# Altium project LEDS.PrjPcb
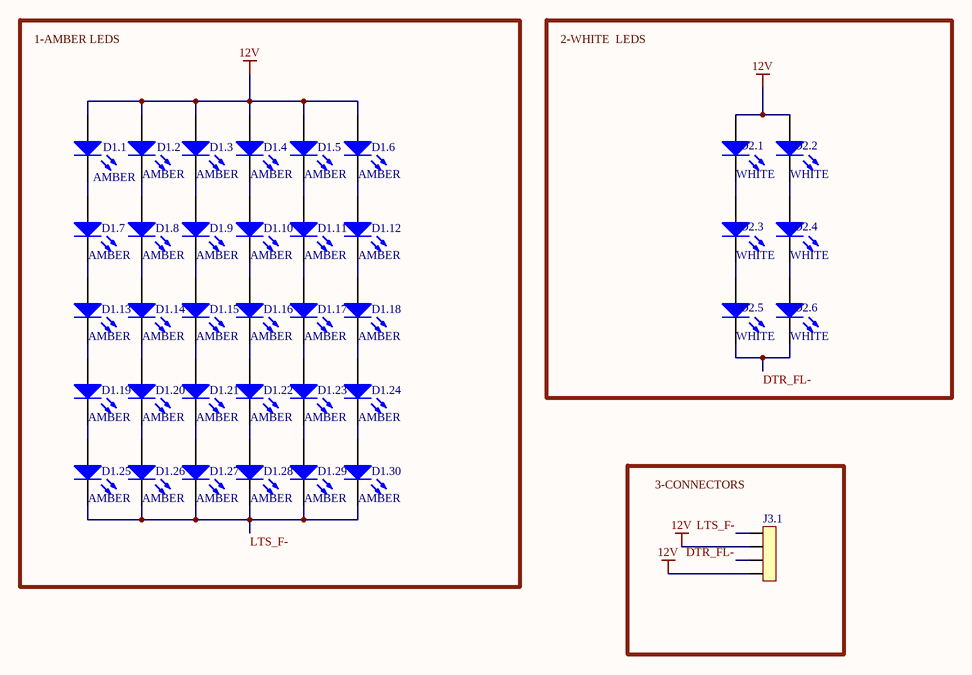
[diagram p0: LEDBoard.SchDoc]
1 sheet, 37 parts. Net scope: global (net labels, ports and power ports of the same name join across sheets).
Board file: LEDBoard.PcbDoc

## Sheet LEDBoard.SchDoc
size A4

### Parts
D1.1  AMBER  [150120AS75000]
D1.2  AMBER  [150120AS75000]
D1.3  AMBER  [150120AS75000]
D1.4  AMBER  [150120AS75000]
D1.5  AMBER  [150120AS75000]
D1.6  AMBER  [150120AS75000]
D1.7  AMBER  [150120AS75000]
D1.8  AMBER  [150120AS75000]
D1.9  AMBER  [150120AS75000]
D1.10  AMBER  [150120AS75000]
D1.11  AMBER  [150120AS75000]
D1.12  AMBER  [150120AS75000]
D1.13  AMBER  [150120AS75000]
D1.14  AMBER  [150120AS75000]
D1.15  AMBER  [150120AS75000]
D1.16  AMBER  [150120AS75000]
D1.17  AMBER  [150120AS75000]
D1.18  AMBER  [150120AS75000]
D1.19  AMBER  [150120AS75000]
D1.20  AMBER  [150120AS75000]
D1.21  AMBER  [150120AS75000]
D1.22  AMBER  [150120AS75000]
D1.23  AMBER  [150120AS75000]
D1.24  AMBER  [150120AS75000]
D1.25  AMBER  [150120AS75000]
D1.26  AMBER  [150120AS75000]
D1.27  AMBER  [150120AS75000]
D1.28  AMBER  [150120AS75000]
D1.29  AMBER  [150120AS75000]
D1.30  AMBER  [150120AS75000]
D2.1  WHITE  [HSMW-C170-U0000]
D2.2  WHITE  [HSMW-C170-U0000]
D2.3  WHITE  [HSMW-C170-U0000]
D2.4  WHITE  [HSMW-C170-U0000]
D2.5  WHITE  [HSMW-C170-U0000]
D2.6  WHITE  [HSMW-C170-U0000]
J3.1  B04B-XASK-1-A(LF)(SN)  [B04B-XASK-1-A]  (value not drawn)

### Blocks framed on the sheet
1-AMBER LEDS: D1.1-D1.30
2-WHITE  LEDS: D2.1-D2.6
3-CONNECTORS: J3.1

### Nets
12V: D1.1.2(A) D1.2.2(A) D1.3.2(A) D1.4.2(A) D1.5.2(A) D1.6.2(A) D2.1.2(A) D2.2.2(A) J3.1.2 J3.1.4
DTR_FL-: D2.5.1(K) D2.6.1(K) J3.1.3
LTS_F-: D1.25.1(K) D1.26.1(K) D1.27.1(K) D1.28.1(K) D1.29.1(K) D1.30.1(K) J3.1.1
NetD1.1_1: D1.1.1(K) D1.7.2(A)
NetD1.2_1: D1.2.1(K) D1.8.2(A)
NetD1.3_1: D1.3.1(K) D1.9.2(A)
NetD1.4_1: D1.4.1(K) D1.10.2(A)
NetD1.5_1: D1.5.1(K) D1.11.2(A)
NetD1.6_1: D1.6.1(K) D1.12.2(A)
NetD1.7_1: D1.7.1(K) D1.13.2(A)
NetD1.8_1: D1.8.1(K) D1.14.2(A)
NetD1.9_1: D1.9.1(K) D1.15.2(A)
NetD1.10_1: D1.10.1(K) D1.16.2(A)
NetD1.11_1: D1.11.1(K) D1.17.2(A)
NetD1.12_1: D1.12.1(K) D1.18.2(A)
NetD1.13_1: D1.13.1(K) D1.19.2(A)
NetD1.14_1: D1.14.1(K) D1.20.2(A)
NetD1.15_1: D1.15.1(K) D1.21.2(A)
NetD1.16_1: D1.16.1(K) D1.22.2(A)
NetD1.17_1: D1.17.1(K) D1.23.2(A)
NetD1.18_1: D1.18.1(K) D1.24.2(A)
NetD1.19_1: D1.19.1(K) D1.25.2(A)
NetD1.20_1: D1.20.1(K) D1.26.2(A)
NetD1.21_1: D1.21.1(K) D1.27.2(A)
NetD1.22_1: D1.22.1(K) D1.28.2(A)
NetD1.23_1: D1.23.1(K) D1.29.2(A)
NetD1.24_1: D1.24.1(K) D1.30.2(A)
NetD2.1_1: D2.1.1(K) D2.3.2(A)
NetD2.2_1: D2.2.1(K) D2.4.2(A)
NetD2.3_1: D2.3.1(K) D2.5.2(A)
NetD2.4_1: D2.4.1(K) D2.6.2(A)

### Library data of the parts
D1.1-D1.30 = 150120AS75000: WURTH ELEKTRONIK   150120AS75000   LED, 1206, AMBER, 140MCD, 605NM; Manufacturer 1: Wurth Electronics; Color: Orange; Forward Current: 30mA; Forward Voltage: 2V; Viewing Angle: 140°; Lens Style: Clear,Rectangular; Test Current: 20mA; Supplier 1: Digi-Key; Manufacturer Part Number 1: 150120AS75000; Stock 1: 2478; Pricing 1: 1=0.21000, 50=0.19800, 100=0.17100, 500=0.14800 (USD); RoHS: Yes; Mount: Surface Mount; Case/Package: 1206; Case Code (Metric): 3216; Case Code (Imperial): 1206; Min Operating Temperature: -40°C; Max Operating Temperature: 85°C; Luminous Intensity: 140mcd; Package Quantity: 3000; Packaging: Tape and Reel; Wavelength: 605nm; Dominant Wavelength: 605nm; Length: 3.2mm; Height: 0.68mm; Width: 1.6mm; REACH SVHC: Unknown; ComponentLink1URL: https://datasheet.ciiva.com/29561/150120as75000-29561877.pdf?src-supplier=Digi-Key; ComponentLink1Description: https://datasheet.ciiva.com/29561/150120as75000-29561877.pdf?src-supplier=Digi-Key; ComponentLink2URL: https://datasheet.ciiva.com/29279/759439-da-01-en-chipled-1206-w-kl-amb-150120as75000-29279037.pdf?src-supplier=Conrad; ComponentLink2Description: https://datasheet.ciiva.com/29279/759439-da-01-en-chipled-1206-w-kl-amb-150120as75000-29279037.pdf?src-supplier=Conrad; ComponentLink3URL: https://datasheet.ciiva.com/29561/150120as75000-29561878.pdf?src-supplier=Digi-Key; ComponentLink3Description: https://datasheet.ciiva.com/29561/150120as75000-29561878.pdf?src-supplier=Digi-Key; ComponentLink4URL: https://datasheet.ciiva.com/29561/150120as75000-29561879.pdf?src-supplier=Digi-Key; ComponentLink4Description: https://datasheet.ciiva.com/29561/150120as75000-29561879.pdf?src-supplier=Digi-Key; Supplier Part Number 1: 732-4988-1-ND
D2.1-D2.6 = HSMW-C170-U0000: Led, White, 670MCD, 0805; Manufacturer 1: Broadcom Avago; Lens Style: Flat; Forward Voltage: 3.4V; Test Current: 20mA; Viewing Angle: 170°; Lens Size: 1.25mm; Supplier 1: Digi-Key; Manufacturer Part Number 1: HSMW-C170-U0000; Stock 1: 12232; Pricing 1: 1=1.05000, 10=0.81600, 100=0.52470, 500=0.44308, 1000=0.34980 (USD); RoHS: No; Mount: Surface Mount; Case/Package: 0805; Color: White; Case Code (Imperial): 0805; Case Code (Metric): 2012; Packaging: Cut Tape; Luminous Intensity: 670mcd; Length: 2mm; Height: 0.9mm; Width: 1.25mm; ComponentLink1URL: https://docs.broadcom.com/docs/HSMW-C170-U0000-DS100?src-supplier=Digi-Key; ComponentLink1Description: https://docs.broadcom.com/docs/HSMW-C170-U0000-DS100?src-supplier=Digi-Key; Supplier Part Number 1: 516-3993-1-ND
J3.1 = B04B-XASK-1-A(LF)(SN): XA Series 4 Position 2.5mm Pitch Top Entry with Boss ThroughHole Shrouded Header; Manufacturer 1: JST; Number of Positions: 4; Supplier 1: Arrow; Manufacturer Part Number 1: B04B-XASK-1-A(LF)(SN); Stock 1: 380; Pricing 1: 1=0.25960, 10=0.25030, 100=0.16200, 500=0.13850, 1000=0.10710, 5000=0.10160, 10000=0.10130 (USD); RoHS: Yes; Mount: Through Hole; Termination: Crimp; Pitch: 2.5mm; Lead Free: Lead Free; ComponentLink1URL: https://datasheet.ciiva.com/16500/jstb04b-xask-1-a-lf-sn-16500956.pdf?src-supplier=Future+Electronics; ComponentLink1Description: https://datasheet.ciiva.com/16500/jstb04b-xask-1-a-lf-sn-16500956.pdf?src-supplier=Future+Electronics; Supplier Part Number 1: B04B-XASK-1-A(LF)(SN)